# Altium schematic sheet 99Counter.SchDoc
size A
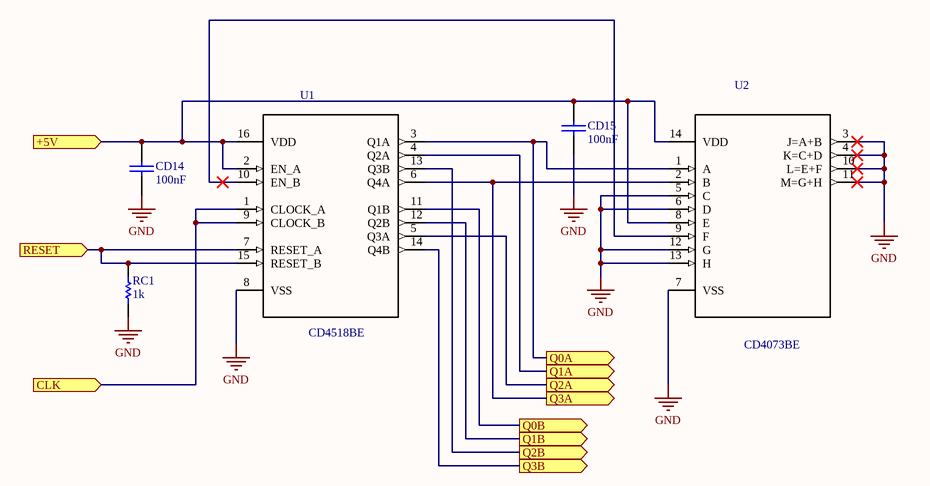
[diagram p0: 99Counter.SchDoc]

## Parts
CD14  100nF  [0805]
CD15  100nF  [0805]
RC1  1k  [0805]
U1  CD4518BE  [*DIP254P762X508-16]
U2  CD4073BE  [*DIP254P762X508-14]

## Ports
+5V (in), CLK (in), Q0A (out), Q0B (out), Q1A (out), Q1B (out), Q2A (out), Q2B (out), Q3A (out), Q3B (out), RESET (in)

## Nets
GND: CD14.2 CD15.2 RC1.1 U1.8(VSS) U2.3(J=A+B) U2.4(K=C+D) U2.5(C) U2.6(D) U2.7(VSS) U2.10(L=E+F) U2.11(M=G+H) U2.12(G) U2.13(H)
+5V: CD14.1 CD15.1 U1.2(EN_A) U1.16(VDD) U2.8(E) U2.14(VDD) ; port +5V
CLK: U1.1(CLOCK_A) U1.9(CLOCK_B) ; port CLK
Q0A: U1.3(Q1A) U2.1(A) ; port Q0A
Q0B: U1.11(Q1B) ; port Q0B
Q1A: U1.4(Q2A) ; port Q1A
Q1B: U1.12(Q2B) ; port Q1B
Q2A: U1.5(Q3A) ; port Q2A
Q2B: U1.13(Q3B) ; port Q2B
Q3A: U1.6(Q4A) U2.2(B) ; port Q3A
Q3B: U1.14(Q4B) ; port Q3B
RESET: RC1.2 U1.7(RESET_A) U1.15(RESET_B) ; port RESET
NetU1_10: U1.10(EN_B) U2.9(F)

## Library data of the parts
CD14 CD15 = CAP
RC1 = RES
U1 = CD4518BE: MF: Texas Instruments; MP: CD4518BE; SnapEDA_Link: https://www.snapeda.com/parts/CD4518BE/Texas%20Instruments/view-part/?ref=snap; Price: None; Package: DIP-16 RCA; Availability: Unavailable; Value: *
U2 = CD4073BE: IC: digital; AND; Channels: 3; Inputs: 3; CMOS; THT; DIP1; MF: Texas Instruments; Package: DIP-14 Texas Instruments; Availability: Unavailable; MP: CD4073BE; SnapEDA_Link: https://www.snapeda.com/parts/CD4073BE/Texas%20Instruments/view-part/?ref=snap; Price: None; Value: *